# EAGLE board openlux (EAGLE 8.4.3), part 1 of 2
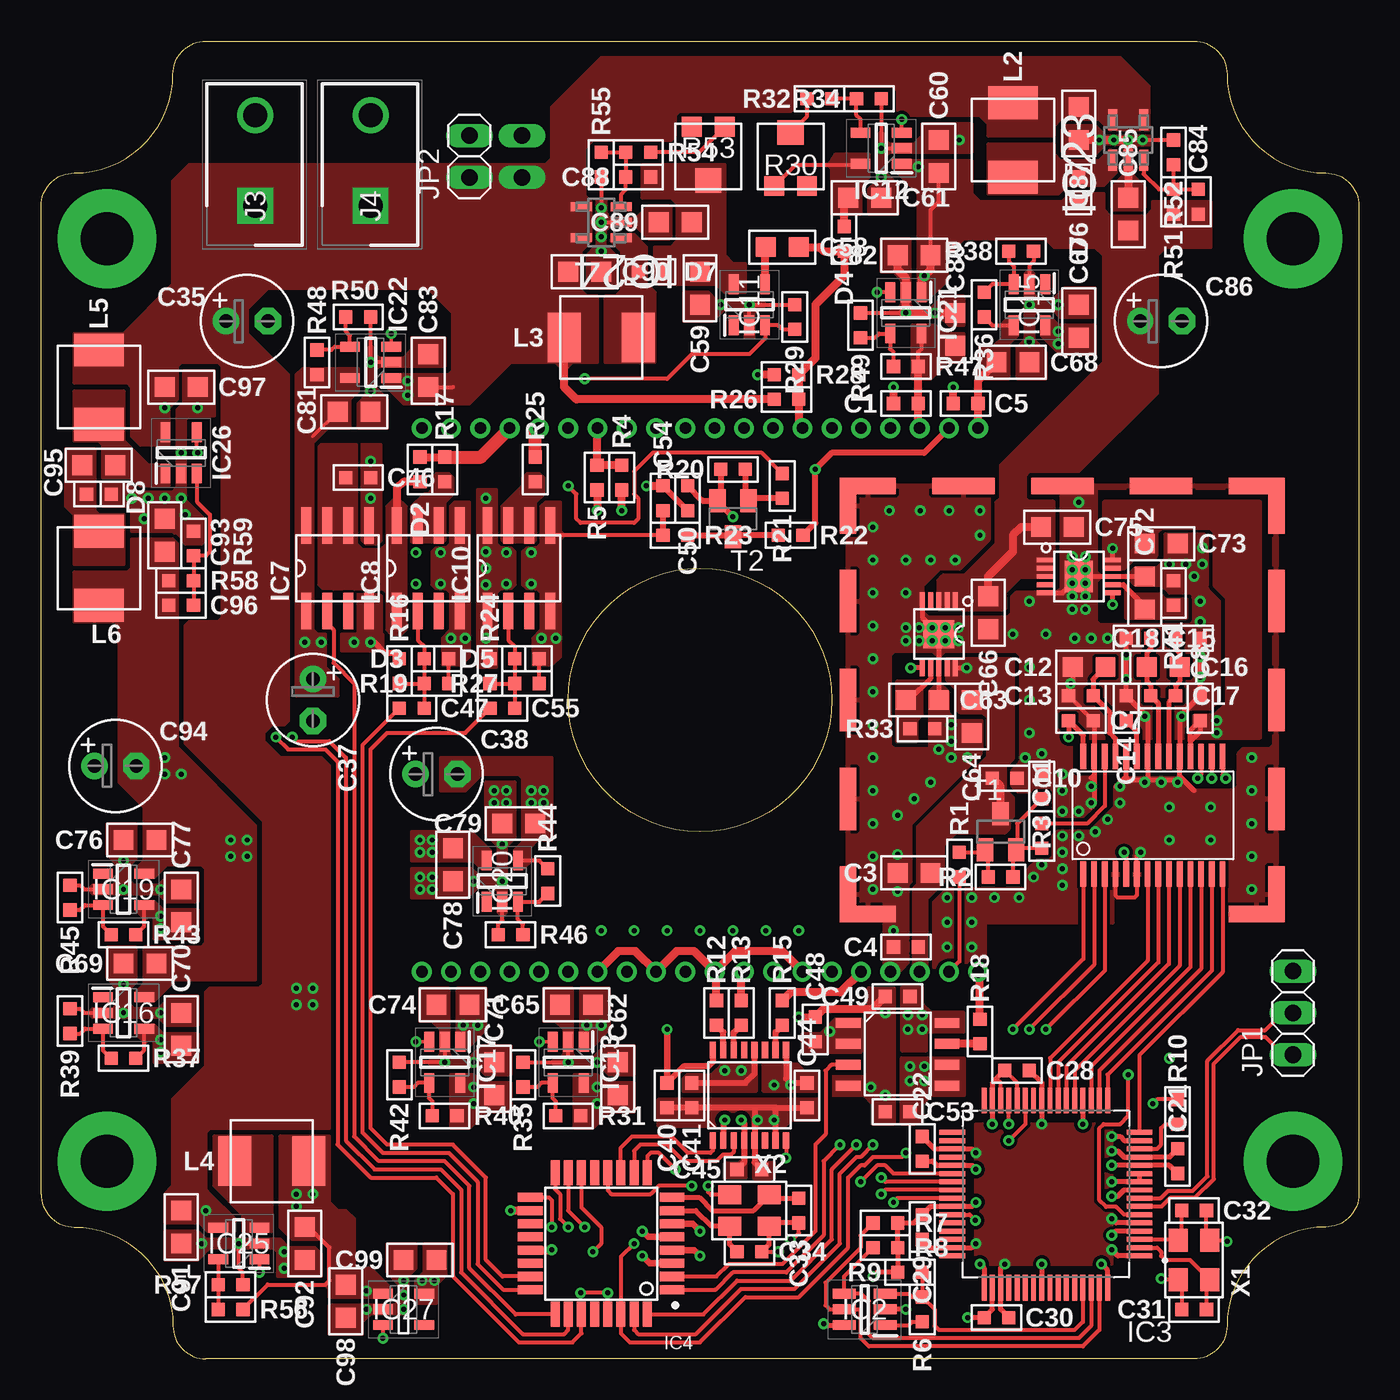
[diagram p6: board, top side]
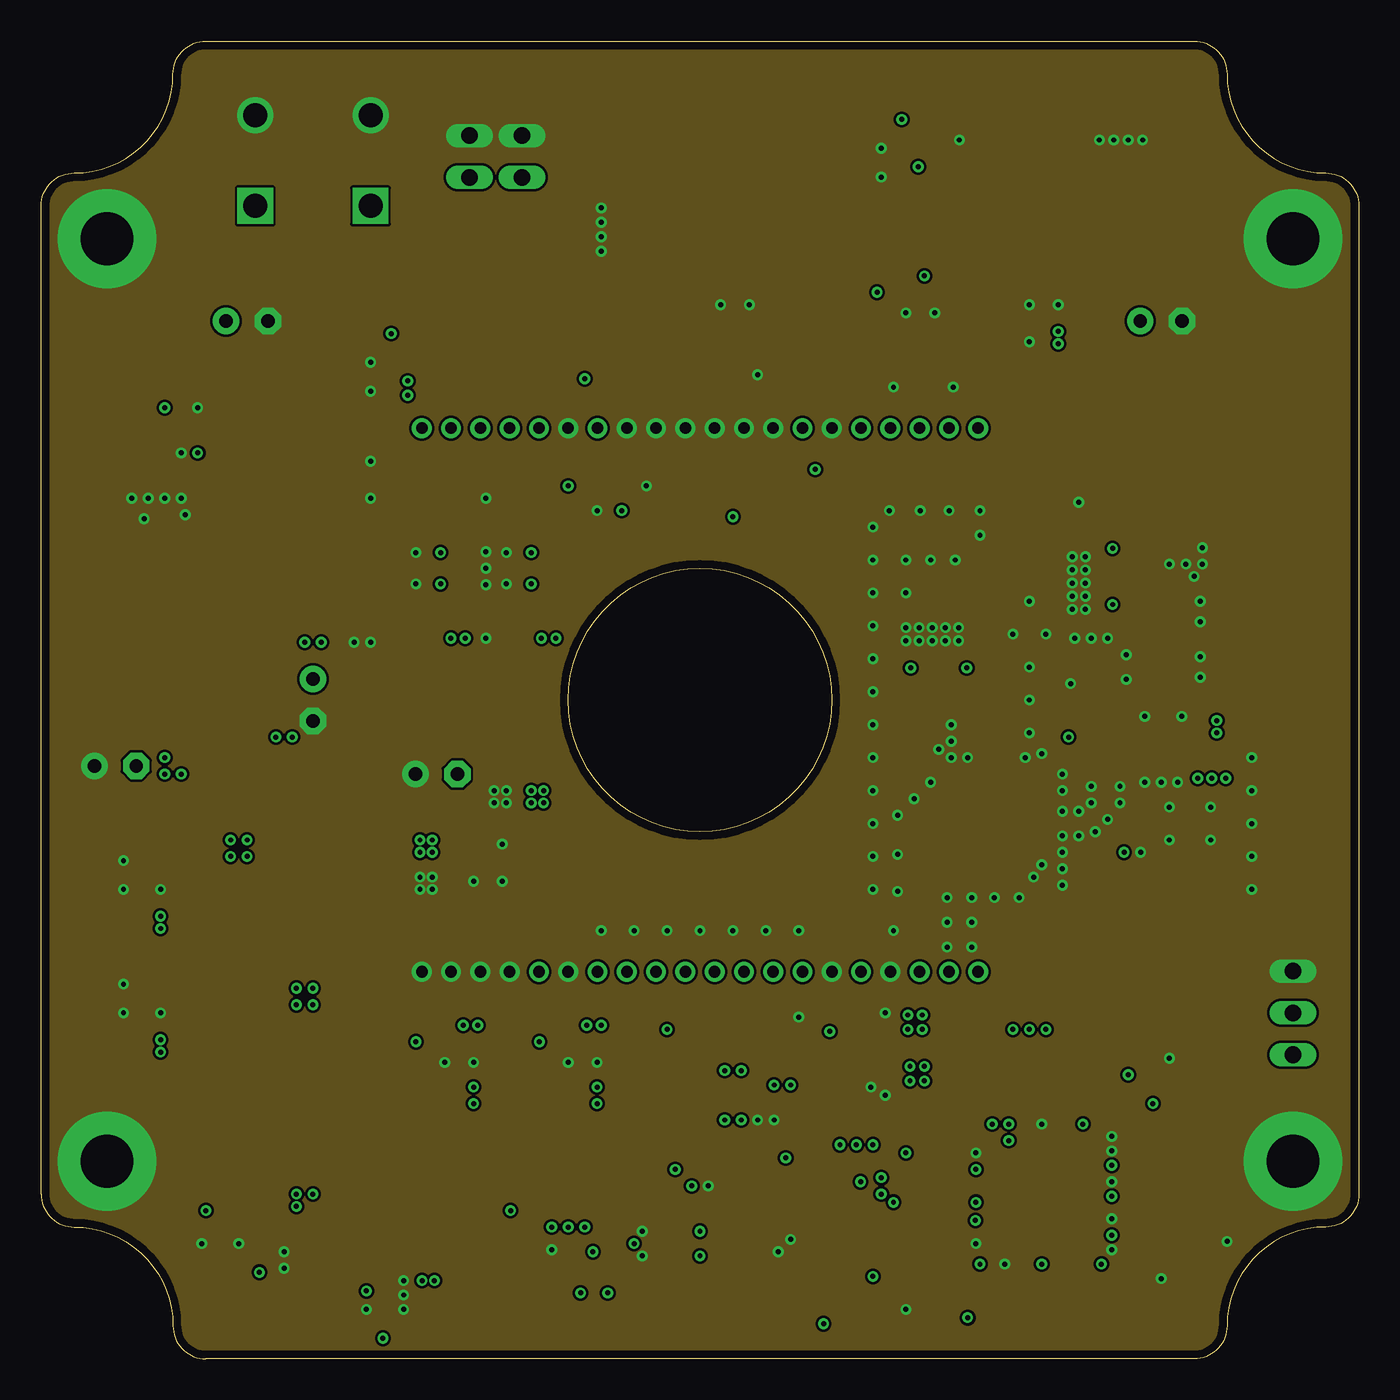
[diagram p7: board, inner layer Route2]
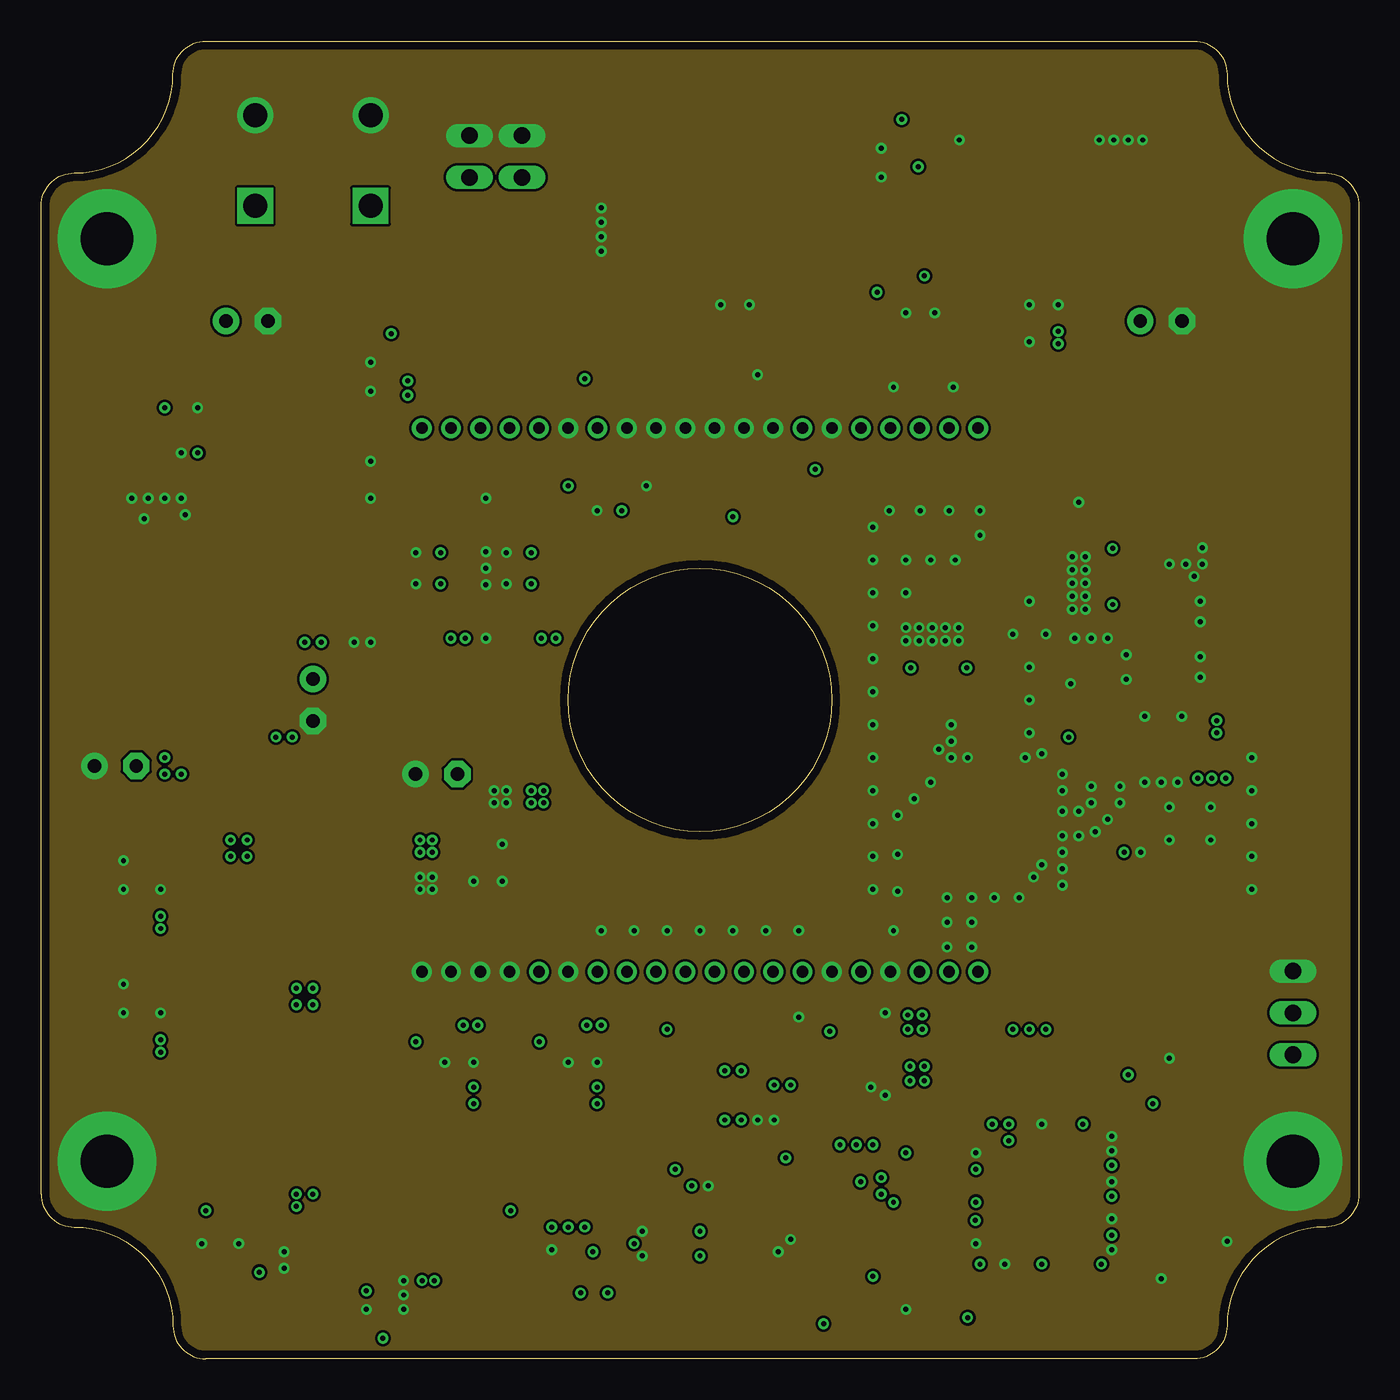
[diagram p8: board, inner layer Route15]
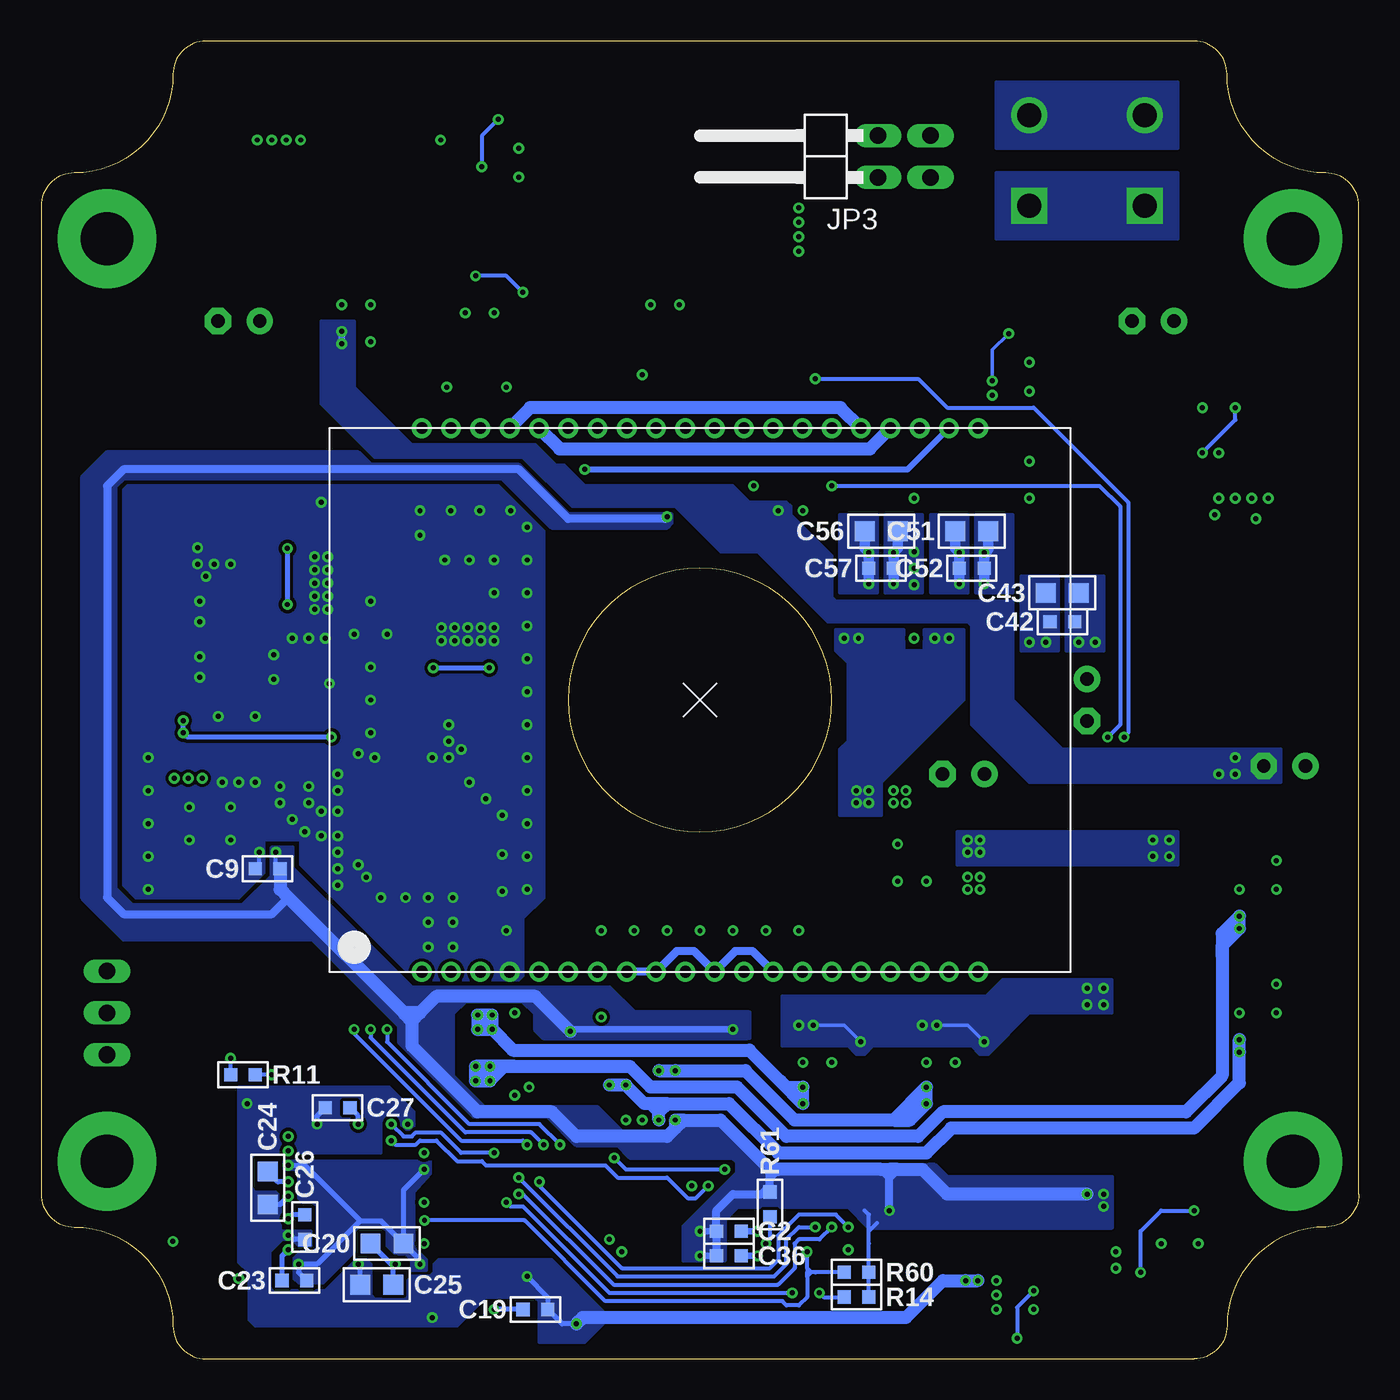
[diagram p9: board, bottom side, seen from below]

Size 80 x 80 mm. Coordinates in mm from the lower left corner, seen from the top.
Outline: 40,48 arc-90 48,40 arc-90 40,32 arc-90 32,40 arc-90 40,48
Outline: 8,78 arc-90 10,80 70,80 arc-90 72,78 arc90 78,72 arc-90 80,70 80,10 arc-90 78,8 arc90 72,2 arc-90 70,0 10,0 arc-90 8,2 arc90 2,8 arc-90 0,10 0,70 arc-90 2,72 arc90 8,78
Copper layers (1*2+15*16): Top 0.035mm / dielectric 0.2mm / Route2 0.0175mm / dielectric 1.065mm / Route15 0.0175mm / dielectric 0.2mm / Bottom 0.035mm
Design rules "default *": minimum track width 0.15mm, minimum drill 0.3mm, track to track 6mil, track to pad 6mil, pad to pad 6mil, via to via 0.2mm, smd to smd 0mil, copper to edge 0.5mm, drill to drill 6mil, minimum pad ring 0.2mm, minimum via ring 0.15mm, stop-mask expansion 4mil, vias tented up to drill 0.4mm, thermal gap 0.2mm
Net classes: 1 usb: width 0.25 mm

## Footprints (pad centres in the part's own frame; a part is rotated, then mirrored left to right if it is on the bottom)
0603 = smd 0.8 x 0.8: 1 -0.75,0; 2 0.75,0
0805 = smd 1.2 x 1.2: 1 -1,0; 2 1,0
E2,5-6 = drill 0.813 pad 1.6: + -1.27,0 | drill 0.813 pad 1.6 octagon: - 1.27,0
SOD523 = smd 0.8 x 0.8: 1 -0.75,0; 2 0.75,0
SSOP28 = smd 0.35 x 1.55: 1 -4.225,-3.575; 2 -3.575,-3.575; 3 -2.925,-3.575; 4 -2.275,-3.575; 5 -1.625,-3.575; 6 -0.975,-3.575; 7 -0.325,-3.575; 8 0.325,-3.575; 9 0.975,-3.575; 10 1.625,-3.575; 11 2.275,-3.575; 12 2.925,-3.575; 13 3.575,-3.575; 14 4.225,-3.575; 15 4.225,3.575; 16 3.575,3.575; 17 2.925,3.575; 18 2.275,3.575; 19 1.625,3.575; 20 0.975,3.575; 21 0.325,3.575; 22 -0.325,3.575; 23 -0.975,3.575; 24 -1.625,3.575; 25 -2.275,3.575; 26 -2.925,3.575; 27 -3.575,3.575; 28 -4.225,3.575
SOT95P270X145-6N = smd 1.4 x 0.6: 1 -1.25,0.95; 2 -1.25,0; 3 -1.25,-0.95; 4 1.25,-0.95; 5 1.25,0; 6 1.25,0.95
QFP50P1200X1200X160-64N = smd 1.56 x 0.3: 1 -5.68,3.75; 2 -5.68,3.25; 3 -5.68,2.75; 4 -5.68,2.25; 5 -5.68,1.75; 6 -5.68,1.25; 7 -5.68,0.75; 8 -5.68,0.25; 9 -5.68,-0.25; 10 -5.68,-0.75; 11 -5.68,-1.25; 12 -5.68,-1.75; 13 -5.68,-2.25; 14 -5.68,-2.75; 15 -5.68,-3.25; 16 -5.68,-3.75; 33 5.68,-3.75; 34 5.68,-3.25; 35 5.68,-2.75; 36 5.68,-2.25; 37 5.68,-1.75; 38 5.68,-1.25; 39 5.68,-0.75; 40 5.68,-0.25; 41 5.68,0.25; 42 5.68,0.75; 43 5.68,1.25; 44 5.68,1.75; 45 5.68,2.25; 46 5.68,2.75; 47 5.68,3.25; 48 5.68,3.75 | smd 0.3 x 1.56: 17 -3.75,-5.68; 18 -3.25,-5.68; 19 -2.75,-5.68; 20 -2.25,-5.68; 21 -1.75,-5.68; 22 -1.25,-5.68; 23 -0.75,-5.68; 24 -0.25,-5.68; 25 0.25,-5.68; 26 0.75,-5.68; 27 1.25,-5.68; 28 1.75,-5.68; 29 2.25,-5.68; 30 2.75,-5.68; 31 3.25,-5.68; 32 3.75,-5.68; 49 3.75,5.68; 50 3.25,5.68; 51 2.75,5.68; 52 2.25,5.68; 53 1.75,5.68; 54 1.25,5.68; 55 0.75,5.68; 56 0.25,5.68; 57 -0.25,5.68; 58 -0.75,5.68; 59 -1.25,5.68; 60 -1.75,5.68; 61 -2.25,5.68; 62 -2.75,5.68; 63 -3.25,5.68; 64 -3.75,5.68
QFP80P900X900X120-32N = smd 1.5 x 0.55: 1 -4.3,2.8; 2 -4.3,2; 3 -4.3,1.2; 4 -4.3,0.4; 5 -4.3,-0.4; 6 -4.3,-1.2; 7 -4.3,-2; 8 -4.3,-2.8; 17 4.3,-2.8; 18 4.3,-2; 19 4.3,-1.2; 20 4.3,-0.4; 21 4.3,0.4; 22 4.3,1.2; 23 4.3,2; 24 4.3,2.8 | smd 0.55 x 1.5: 9 -2.8,-4.3; 10 -2,-4.3; 11 -1.2,-4.3; 12 -0.4,-4.3; 13 0.4,-4.3; 14 1.2,-4.3; 15 2,-4.3; 16 2.8,-4.3; 25 2.8,4.3; 26 2,4.3; 27 1.2,4.3; 28 0.4,4.3; 29 -0.4,4.3; 30 -1.2,4.3; 31 -2,4.3; 32 -2.8,4.3
QSOP16 = smd 0.385 x 1: 1 -2.223,-2.75; 2 -1.587,-2.75; 3 -0.953,-2.75; 4 -0.318,-2.75; 5 0.318,-2.75; 6 0.953,-2.75; 7 1.587,-2.75; 8 2.223,-2.75; 9 2.223,2.75; 10 1.587,2.75; 11 0.953,2.75; 12 0.318,2.75; 13 -0.318,2.75; 14 -0.953,2.75; 15 -1.587,2.75; 16 -2.223,2.75
SOIC8 = smd 0.6 x 2.2: 1 -1.905,-2.6; 2 -0.635,-2.6; 3 0.635,-2.6; 4 1.905,-2.6; 5 1.905,2.6; 6 0.635,2.6; 7 -0.635,2.6; 8 -1.905,2.6
SOIC8' = smd 0.6 x 1.5: 1 -1.89,-3; 2 -0.62,-3; 3 0.65,-3; 4 1.92,-3; 5 1.92,3; 6 0.65,3; 7 -0.62,3; 8 -1.89,3
SOT95P280X145-5N = smd 1.2 x 0.6: 1 -1.25,0.95; 2 -1.25,0; 3 -1.25,-0.95; 4 1.25,-0.95; 5 1.25,0.95
MSOP10 = smd 0.3 x 1: 1 -1,-2.05; 2 -0.5,-2.05; 3 0,-2.05; 4 0.5,-2.05; 5 1,-2.05; 6 1,2.05; 7 0.5,2.05; 8 0,2.05; 9 -0.5,2.05; 10 -1,2.05 | smd 1.9 x 1.7: EP 0,0
SOT95P284X119-5N = smd 1.27 x 0.533: 1 -1.219,0.94; 2 -1.219,0; 3 -1.219,-0.94; 4 1.219,-0.94; 5 1.219,0.94
SOT95P280X130-5N = smd 1.2 x 0.6: 1 -1.25,0.95; 2 -1.25,0; 3 -1.25,-0.95; 4 1.25,-0.95; 5 1.25,0.95
KAI-11002 = drill 0.7 pad 1.2: 1 -16.891,-16.5; 2 -15.113,-16.5; 3 -13.335,-16.5; 4 -11.557,-16.5; 5 -9.779,-16.5; 6 -8.001,-16.5; 7 -6.223,-16.5; 8 -4.445,-16.5; 9 -2.667,-16.5; 10 -0.889,-16.5; 11 0.889,-16.5; 12 2.667,-16.5; 13 4.445,-16.5; 14 6.223,-16.5; 15 8.001,-16.5; 16 9.779,-16.5; 17 11.557,-16.5; 18 13.335,-16.5; 19 15.113,-16.5; 20 16.891,-16.5; 21 16.891,16.5; 22 15.113,16.5; 23 13.335,16.5; 24 11.557,16.5; 25 9.779,16.5; 26 8.001,16.5; 27 6.223,16.5; 28 4.445,16.5; 29 2.667,16.5; 30 0.889,16.5; 31 -0.889,16.5; 32 -2.667,16.5; 33 -4.445,16.5; 34 -6.223,16.5; 35 -8.001,16.5; 36 -9.779,16.5; 37 -11.557,16.5; 38 -13.335,16.5; 39 -15.113,16.5; 40 -16.891,16.5
SHDR2W125P0X550_1X2_960X540X13 = drill 1.45 pad 2.175 square: 1 0,0 | drill 1.45 pad 2.175: 2 -5.5,0
1X03 = drill 1.016 long: 1 -2.54,0; 2 0,0; 3 2.54,0
1X02 = drill 1.016 long: 1 -1.27,0; 2 1.27,0
1X02/90 = drill 1.016 long: 1 -1.27,-3.81; 2 1.27,-3.81
5X5_2 = smd 2 x 3: P$1 -2.25,0; P$2 2.25,0
TC33X2 = smd 1.2 x 1.2: 1 -1,-1.8; 3 1,-1.8 | smd 1.6 x 1.5: 2 0,1.45
BMI-S-203-F = smd 1 x 3.8: P$1 -13,0; P$2 -13,6; P$3 -13,-6; P$6 13,0; P$7 13,6; P$8 13,-6 | smd 1 x 3.4: P$4 -13,11.8; P$5 -13,-11.8; P$9 13,11.8; P$10 13,-11.8 | smd 3.8 x 1: P$11 0,13; P$12 -6,13; P$13 6,13 | smd 3.4 x 1: P$14 -11.8,13; P$15 11.8,13; P$19 -11.8,-13; P$20 11.8,-13
SOT23 = smd 1 x 1.4: 1 -0.95,-1.1; 2 0.95,-1.1; 3 0,1.1
SOT23-BEC = smd 1 x 1.4: B -0.95,-1.1; C 0,1.1; E 0.95,-1.1
3.2X2.5_4 = smd 1.4 x 1.15: P$1 -1.2,-0.95; P$2 1.2,-0.95; P$3 1.2,0.95; P$4 -1.2,0.95

## Placement (x,y rotation side)
C1  100nF  [0603]  52.5,58 180 top
C2  100nF  [0603]  38.25,7.75 0 bottom
C3  10uF  [0805]  53,29.5 180 top
C4  100nF  [0603]  52.5,25 180 top
C5  100nF  [0603]  56.12,58 0 top
C7  100nF  [0603]  63.12,38.75 0 top
C8  100nF  [0603]  70.38,39.5 90 top
C9  100nF  [0603]  66.25,29.75 180 bottom
C10  100nF  [0603]  58.5,35.25 0 top
C11  100nF  [0603]  60.75,31.75 90 top
C12  10uF  [0805]  63.62,42 180 top
C13  100nF  [0603]  63.12,40.25 180 top
C14  100nF  [0603]  65.88,39.5 270 top
C15  100nF  [0603]  66.62,43.75 0 top
C16  10uF  [0805]  68.12,42 0 top
C17  100nF  [0603]  68.12,40.25 0 top
C18  100nF  [0603]  69.62,43.75 180 top
C19  100nF  [0603]  50,3 180 bottom
C20  10uF  [0805]  59,7 180 bottom
C21  100nF  [0603]  69,12 90 top
C22  100nF  [0603]  53.5,12.75 90 top
C23  100nF  [0603]  64.62,4.75 180 bottom
C24  10uF  [0805]  66.25,10.38 90 bottom
C25  10uF  [0805]  59.62,4.5 0 bottom
C26  100nF  [0603]  64,8 90 bottom
C27  100nF  [0603]  62,15.25 0 bottom
C28  100nF  [0603]  59.25,17.5 0 top
C29  100nF  [0603]  53.5,8 270 top
C30  100nF  [0603]  58,2.5 0 top
C31  22pF  [0603]  70,3 180 top
C32  22pF  [0603]  70,9 0 top
C33  22pF  [0603]  46,9 270 top
C34  22pF  [0603]  43,6.5 0 top
C35  100uF 25V  [E2,5-6]  12.5,63 0 top
C36  100nF  [0603]  38.25,6.25 0 bottom
C37  100uF 25V  [E2,5-6]  16.5,40 270 top
C38  100uF 25V  [E2,5-6]  24,35.5 0 top
C40  100nF  [0603]  38,16 270 top
C41  100nF  [0603]  39.5,16 270 top
C42  100nF  [0603]  18,44.75 180 bottom
C43  10uF  [0805]  18,46.5 180 bottom
C44  100nF  [0603]  46.5,16 90 top
C45  100nF  [0603]  43,11.5 180 top
C46  10nF  [0603]  19.25,53.5 0 top
C47  100nF  [0603]  22.5,39.5 0 top
C48  100nF  [0603]  47,20 90 top
C49  100nF  [0603]  52,22 180 top
C50  100nF  [0603]  39.25,52.25 270 top
C51  10uF  [0805]  23.5,50.25 180 bottom
C52  100nF  [0603]  23.5,48 180 bottom
C53  100nF  [0603]  52,15 0 top
C54  100nF  [0603]  37.75,52.25 90 top
C55  100nF  [0603]  28,39.5 0 top
C56  10uF  [0805]  29,50.25 180 bottom
C57  100nF  [0603]  29,48 180 bottom
C58  4.7uF 35V  [0805]  45,67.5 0 top
C59  4.7uF 35V  [0805]  40,65 270 top
C60  4.7uF 35V  [0805]  54.5,73 90 top
C61  10uF  [0805]  50,70.5 0 top
C62  10uF  [0805]  35,17 90 top
C63  10uF  [0805]  53.5,40 0 top
C64  10uF  [0805]  56.5,39 270 top
C65  10uF  [0805]  32.5,21.5 180 top
C66  10uF  [0805]  57.5,45.3 270 top
C67  10uF  [0805]  63,63 90 top
C68  10uF  [0805]  59,60.5 0 top
C69  10uF  [0805]  6,24 180 top
C70  10uF  [0805]  8.5,20 90 top
C71  10uF  [0805]  27.5,17 90 top
C72  10uF  [0805]  67,46.5 90 top
C73  10uF  [0805]  68,49.5 0 top
C74  10uF  [0805]  25,21.5 180 top
C75  10uF  [0805]  61.7,50.5 0 top
C76  10uF  [0805]  6,31.5 180 top
C77  10uF  [0805]  8.5,27.5 90 top
C78  10uF  [0805]  25,30 270 top
C79  10uF  [0805]  29,32.5 180 top
C80  10uF  [0805]  55.5,62.5 90 top
C81  10uF  [0805]  19,57.5 0 top
C82  4.7uF 35V  [0805]  53,67 180 top
C83  10uF  [0805]  23.5,60 90 top
C84  150pF  [0603]  70.25,70.25 90 top
C85  4.7uF 35V  [0805]  66,69.5 90 top
C86  100uF 25V  [E2,5-6]  68,63 0 top
C87  10uF  [0805]  63,75 270 top
C88  150pF  [0603]  36.25,71.75 180 top
C89  4.7uF 35V  [0805]  38.5,69 180 top
C90  10uF  [0805]  33,66 0 top
C91  10uF  [0805]  8.5,8 270 top
C92  10uF  [0805]  16,7 270 top
C93  10uF  [0805]  7.5,50 270 top
C94  100uF 25V  [E2,5-6]  4.5,36 0 top
C95  4.7uF 35V  [0805]  3.5,54.25 180 top
C96  150pF  [0603]  8.5,45.75 0 top
C97  10uF  [0805]  8.5,59 0 top
C98  10uF  [0805]  18.5,3.5 270 top
C99  10uF  [0805]  23,6 180 top
D2  SCHOTTKY  [SOD523]  23,54 270 top
D3  5.1VZ  [SOD523]  24,42.5 180 top
D4  SCHOTTKY  [SOD523]  48.75,68 270 top
D5  5.1VZ  [SOD523]  29.5,42.5 180 top
D6  SCHOTTKY  [SOD523]  63,71 270 top
D7  SCHOTTKY  [SOD523]  37,66 0 top
D8  SCHOTTKY  [SOD523]  3.5,52.5 0 top
EXTRA1  4x R30-1001502  [EMPTY]  -6,-2 0 top  (outside the outline)
EXTRA2  Hammond 1590WY  [EMPTY]  -6,-5 0 top  (outside the outline)
EXTRA3  M3 6 KRSTMC Z100  [EMPTY]  -6,-8 0 top  (outside the outline)
EXTRA4  M3 6 PRSTMC Z100  [EMPTY]  -6,-11 0 top  (outside the outline)
EXTRA5  TEC2-1900(3/6)  [EMPTY]  -6,-14 0 top  (outside the outline)
EXTRA6  2x 39-01-2020  [EMPTY]  -6,-17 0 top  (outside the outline)
EXTRA7  4x 39-00-0039  [EMPTY]  -6,-20 0 top  (outside the outline)
EXTRA8  Lumberg 1614 16  [EMPTY]  -6,-23 0 top  (outside the outline)
EXTRA9  Noctua L9i + Thermal paste  [EMPTY]  -6,-26 0 top  (outside the outline)
EXTRA10  MUSBR-M5C1-M0  [EMPTY]  -6,-29 0 top  (outside the outline)
EXTRA11  BMI-S-203-C  [EMPTY]  -6,-32 0 top  (outside the outline)
EXTRA12  D8864-42  [EMPTY]  -6,-35 0 top  (outside the outline)
IC1  AD9826  [SSOP28]  67.5,33 0 top
IC2  93LC56BT-I_OT  [SOT95P270X145-6N]  50,3 180 top
IC3  FT2232HL-REEL  [QFP50P1200X1200X160-64N]  61,10 180 top
IC4  ATMEGA328P-AU  [QFP80P900X900X120-32N]  34,7 180 top
IC6  EL7457  [QSOP16]  43,16 0 top
IC7  TC4452VOA  [SOIC8]  18,48 0 top
IC8  TC4452VOA  [SOIC8]  23.5,48 0 top
IC9  EL7156  [SOIC8']  52,18.5 270 top
IC10  TC4452VOA  [SOIC8]  29,48 0 top
IC11  UCC27537DBVT  [SOT95P280X145-5N]  43,64 90 top
IC12  MIC5235YM5-TR  [SOT95P280X145-5N]  51,73.5 180 top
IC13  MIC5235YM5-TR  [SOT95P280X145-5N]  32,18 270 top
IC14  LT3042MSOP10  [MSOP10]  54.5,44 180 top
IC15  MIC5270YM5-TR  [SOT95P280X145-5N]  60,64 270 top
IC16  MIC5270YM5-TR  [SOT95P280X145-5N]  5,21 0 top
IC17  MIC5235YM5-TR  [SOT95P280X145-5N]  24.5,18 270 top
IC18  LT3042MSOP10  [MSOP10]  63,47.5 270 top
IC19  MIC5270YM5-TR  [SOT95P280X145-5N]  5,28.5 0 top
IC20  MIC5270YM5-TR  [SOT95P280X145-5N]  28,29 90 top
IC21  MIC5235YM5-TR  [SOT95P280X145-5N]  52.5,63.5 270 top
IC22  MIC5235YM5-TR  [SOT95P280X145-5N]  20,60.5 180 top
IC23  LM2733XMF  [SOT95P284X119-5N]  66,74 90 top
IC24  LM2733XMF  [SOT95P284X119-5N]  34,69 180 top
IC25  TPS560200DBVT  [SOT95P280X145-5N]  12,7 180 top
IC26  LM2611BMF  [SOT95P280X145-5N]  8.5,55 90 top
IC27  MIC5504-3.3YM5-TR  [SOT95P280X130-5N]  22,3 0 top
IS1  KAI-11002  [KAI-11002]  40,40 0 bottom
J3  39-29-3026  [SHDR2W125P0X550_1X2_960X540X13]  13,70 270 top
J4  39-29-3026  [SHDR2W125P0X550_1X2_960X540X13]  20,70 270 top
JP1  [1X03]  76,21 90 top
JP2  [1X02]  26,73 90 top
JP3  [1X02/90]  33,73 90 bottom
L2  SRN5040-220M  [5X5_2]  59,74 90 top
L3  SRN5040-220M  [5X5_2]  34,62 180 top
L4  SRN5040-220M  [5X5_2]  14,12 180 top
L5  SRN5040-220M  [5X5_2]  3.5,59 90 top
L6  SRN5040-220M  [5X5_2]  3.5,48 90 top
R1  22R  [0603]  55.75,30 90 top
R2  130R  [0603]  58.25,29.25 180 top
R3  1.21K  [0603]  60.75,34.75 270 top
R4  1K  [0603]  35.25,53.5 90 top
R5  2.1K  [0603]  33.75,53.5 270 top
R6  2.1K  [0603]  53.5,3 270 top
R7  10K  [0603]  51.25,8.25 0 top
R8  10K  [0603]  51.25,6.75 0 top
R9  10K  [0603]  52.75,5.25 180 top
R10  10K  [0603]  69,15 90 top
R11  12K  [0603]  67.75,17.25 0 bottom
R12  22R  [0603]  41,21 90 top
R13  22R  [0603]  42.5,21 90 top
R14  10K  [0603]  30.5,3.75 0 bottom
R15  22R  [0603]  45,21 90 top
R16  NC  [0603]  21.75,41.75 90 top
R17  1R  [0603]  24.5,54 90 top
R18  22R  [0603]  57,19.88 90 top
R19  82.5K  [0603]  24,41 180 top
R20  10K  [0603]  42,54 180 top
R21  1K  [0603]  45,53 270 top
R22  22R  [0603]  45.5,50 0 top
R23  1K  [0603]  38.5,50 0 top
R24  64.9K  [0603]  27.25,41.75 90 top
R25  1R  [0603]  30,54 90 top
R26  1K  [0603]  45.25,58.25 180 top
R27  82.5K  [0603]  29.5,41 180 top
R28  1K  [0603]  45.25,59.75 0 top
R29  10K  [0603]  45.75,63.25 270 top
R30  TC33X-2-104E  [TC33X2]  45.5,73 0 top
R31  2.1K  [0603]  32,14.75 0 top
R32  52.3K  [0603]  47.25,76.5 180 top
R33  150K  [0603]  53.5,38.25 180 top
R34  10K  [0603]  50.25,76.5 180 top
R35  10K  [0603]  29.25,17.25 270 top
R36  10.7K  [0603]  57.25,64 270 top
R37  23.2K  [0603]  5,18.25 0 top
R38  10K  [0603]  59.5,67.25 180 top
R39  10K  [0603]  1.75,20.5 270 top
R40  6.12K  [0603]  24.5,14.75 0 top
R41  49.9K  [0603]  68.75,46.5 270 top
R42  10K  [0603]  21.75,17.25 270 top
R43  19.1K  [0603]  5,25.75 0 top
R44  64.9K  [0603]  30.75,29 90 top
R45  10K  [0603]  1.75,28 270 top
R46  10K  [0603]  28.5,25.75 0 top
R47  82.5K  [0603]  52.5,60.25 0 top
R48  54.9K  [0603]  16.75,60.5 270 top
R49  10K  [0603]  49.75,62.75 270 top
R50  10K  [0603]  19.25,63.25 180 top
R51  137K  [0603]  68.75,70.25 270 top
R52  10K  [0603]  68.75,73.25 270 top
R53  TC33X-2-105E  [TC33X2]  40.5,73 180 top
R54  52.3K  [0603]  36.25,73.25 0 top
R55  10K  [0603]  34,72.5 90 top
R56  52.3K  [0603]  11.5,3 0 top
R57  10K  [0603]  11.5,4.5 180 top
R58  84.5K  [0603]  8.5,47.25 180 top
R59  10K  [0603]  9.25,49.5 270 top
R60  10K  [0603]  30.5,5.25 0 bottom
R61  10K  [0603]  35.75,9.38 90 bottom
SH1  BMI-S-203-F  [BMI-S-203-F]  62,40 0 top
T1  BC850  [SOT23]  58.25,32 0 top
T2  BC807  [SOT23-BEC]  42,51 180 top
X1  12MHz  [3.2X2.5_4]  70,6 90 top
X2  20MHz  [3.2X2.5_4]  43,9 180 top